# Altium schematic sheet Shematic_NANO.SchDoc: Arduino Nano
size B; Date: 2022
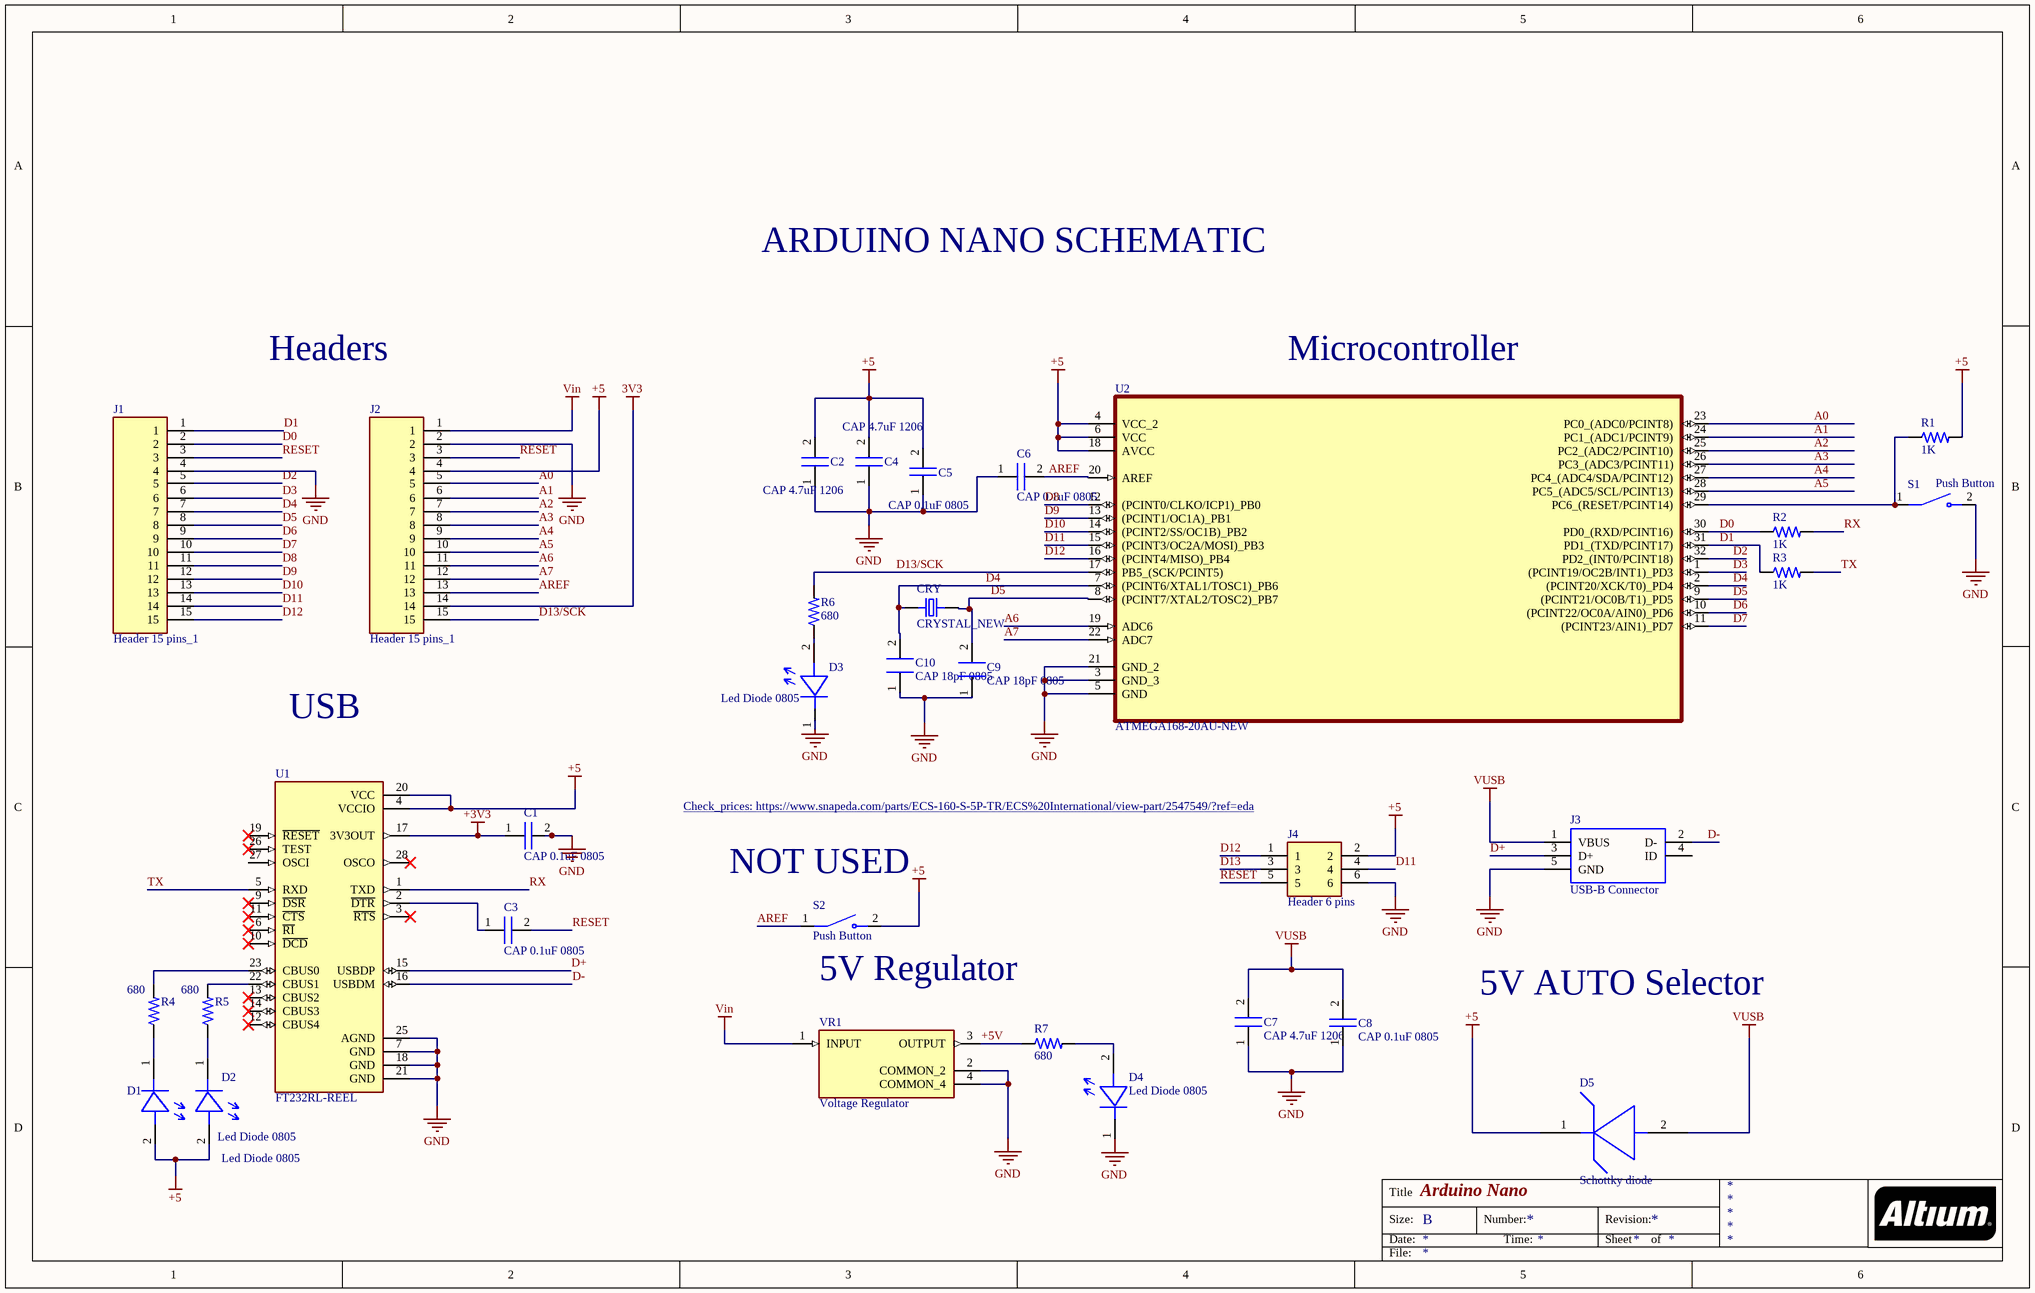
[diagram p0: Shematic_NANO.SchDoc]

## Parts
C1  CAP 0.1uF 0805  [CAP 0.1uF 0805]
C2  CAP 4.7uF 1206  [CAP 4.7 uF 1206]
C3  CAP 0.1uF 0805  [CAP 0.1uF 0805]
C4  CAP 4.7uF 1206  [CAP 4.7 uF 1206]
C5  CAP 0.1uF 0805  [CAP 0.1uF 0805]
C6  CAP 0.1uF 0805  [CAP 0.1uF 0805]
C7  CAP 4.7uF 1206  [CAP 4.7 uF 1206]
C8  CAP 0.1uF 0805  [CAP 0.1uF 0805]
C9  CAP 18pF 0805  [CAP 18pF 0805]
C10  CAP 18pF 0805  [CAP 18pF 0805]
CRY  CRYSTAL_NEW  [CRYSTAL 16MHZ]
D1  Led Diode 0805  [LED 0805]
D2  Led Diode 0805  [LED 0805]
D3  Led Diode 0805  [LED 0805]
D4  Led Diode 0805  [LED 0805]
D5  Schottky diode  [Schottky diode]
J1  Header 15 pins_1  [Header 15 pins]
J2  Header 15 pins_1  [Header 15 pins]
J3  USB-B Connector  [USB-B Connector]
J4  Header 6 pins  [Header 6 pins]
R1  1K  [RES 0402]
R2  1K  [RES 0402]
R3  1K  [RES 0402]
R4  680  [RES 0402]
R5  680  [RES 0402]
R6  680  [RES 0402]
R7  680  [RES 0402]
S1  Push Button  [Push Button]
S2  Push Button  [Push Button]
U1  FT232RL-REEL  [SOP65P780X200-28N]
U2  ATMEGA168-20AU-NEW  [ATMEGA168-20AU - duplicate]
VR1  Voltage Regulator  [Voltage Regulator]

## Nets
3V3: J2.14
+3V3: C1.1 U1.17(3V3OUT)
+5: C2.2 C4.2 C5.2 D1.2 D2.2 D5.1 J2.4 J4.2 R1.2 S2.2 U1.4(VCCIO) U1.20(VCC) U2.4(VCC_2) U2.6(VCC) U2.18(AVCC)
GND: C1.2 C2.1 C4.1 C5.1 C6.1 C7.1 C8.1 C9.1 C10.1 D3.1 D4.1 J1.4 J2.2 J3.5(GND) J4.6 S1.2 U1.7(GND) U1.18(GND) U1.21(GND) U1.25(AGND) U2.3(GND_3) U2.5(GND) U2.21(GND_2) VR1.2(COMMON_2) VR1.4(COMMON_4)
Vin: J2.1 VR1.1(INPUT)
VUSB: C7.2 C8.2 D5.2 J3.1(VBUS)
+5V: R7.1 VR1.3(OUTPUT)
A0: J2.5 U2.23(PC0_(ADC0/PCINT8))
A1: J2.6 U2.24(PC1_(ADC1/PCINT9))
A2: J2.7 U2.25(PC2_(ADC2/PCINT10))
A3: J2.8 U2.26(PC3_(ADC3/PCINT11))
A4: J2.9 U2.27(PC4_(ADC4/SDA/PCINT12))
A5: J2.10 U2.28(PC5_(ADC5/SCL/PCINT13))
A6: J2.11 U2.19(ADC6)
A7: J2.12 U2.22(ADC7)
AREF: C6.2 J2.13 S2.1 U2.20(AREF)
D0: J1.2 R2.1 U2.30(PD0_(RXD/PCINT16))
D1: J1.1 R3.1 U2.31(PD1_(TXD/PCINT17))
D2: J1.5 U2.32(PD2_(INT0/PCINT18))
D3: J1.6 U2.1((PCINT19/OC2B/INT1)_PD3)
D4: C10.2 CRY.1 J1.7 U2.2((PCINT20/XCK/T0)_PD4) U2.7((PCINT6/XTAL1/TOSC1)_PB6)
D5: C9.2 CRY.2 J1.8 U2.8((PCINT7/XTAL2/TOSC2)_PB7) U2.9((PCINT21/OC0B/T1)_PD5)
D6: J1.9 U2.10((PCINT22/OC0A/AIN0)_PD6)
D7: J1.10 U2.11((PCINT23/AIN1)_PD7)
D8: J1.11 U2.12((PCINT0/CLKO/ICP1)_PB0)
D9: J1.12 U2.13((PCINT1/OC1A)_PB1)
D10: J1.13 U2.14((PCINT2/SS/OC1B)_PB2)
D11: J1.14 J4.4 U2.15((PCINT3/OC2A/MOSI)_PB3)
D12: J1.15 J4.1 U2.16((PCINT4/MISO)_PB4)
D13: J4.3
D13/SCK: J2.15 R6.2 U2.17(PB5_(SCK/PCINT5))
D+: J3.3(D+) U1.15(USBDP)
D-: J3.2(D-) U1.16(USBDM)
RESET: C3.2 J1.3 J2.3 J4.5
RX: R2.2 U1.1(TXD)
TX: R3.2 U1.5(RXD)
NetC3_1: C3.1 U1.2(~{DTR})
NetD1_1: D1.1 R4.1
NetD2_1: D2.1 R5.1
NetD3_2: D3.2 R6.1
NetD4_2: D4.2 R7.2
NetR1_1: R1.1 S1.1 U2.29(PC6_(RESET/PCINT14))
NetR4_2: R4.2 U1.23(CBUS0)
NetR5_2: R5.2 U1.22(CBUS1)

Not connected (* = marked no-connect by the designer): J3 4(ID); U1 3(~{RTS})* 6(~{RI})* 9(~{DSR})* 10(~{DCD})* 11(~{CTS})* 12(CBUS4)* 13(CBUS2)* 14(CBUS3)* 19(~{RESET})* 26(TEST)* 27(OSCI) 28(OSCO)*

## Notes on the sheet
- ARDUINO NANO SCHEMATIC
- Headers
- Microcontroller
- USB
- (near S2) NOT USED
- (near S2) 5V Regulator
- 5V AUTO Selector
- Title
- Size:
- Date:
- B
- Number:
- Time:
- Revision:
- Sheet
- of
- File:

## Library data of the parts
CRY = CRYSTAL_NEW: 16MHz Â±30ppm Crystal Series 40 Ohms HC-49/US; MF: ECS International; MP: ECS-160-S-5P-TR; SnapEDA_Link: https://www.snapeda.com/parts/ECS-160-S-5P-TR/ECS%20International/view-part/2547549/?ref=snap; Mouser-Purchase-URL: https://snapeda.com/shop?store=Mouser&id=2547549; Value: *; Availability: Warning; Price: None; Package: HC49/US ECS International; Check_prices: https://www.snapeda.com/parts/ECS-160-S-5P-TR/ECS%20International/view-part/2547549/?ref=eda
D5 = Schottky diode: Schottky diode 0.5A 20V
J1 J2 = Header 15 pins_1: MP: 4-644456-5; Package: None; Price: None; Value: *; Availability: Unavailable
J3 = USB-B Connector: USB - mini B USB 2.0 OTG Receptacle Connector 5 Position Surface Mount, Right Angle; MF: Molex; MP: 67503-1020; SnapEDA_Link: https://www.snapeda.com/parts/67503-1020/Molex/view-part/46840/?ref=snap; Price: None; Value: *; Availability: Unavailable; Package: None
J4 = Header 6 pins: Connector Header Through Hole 6 position 0.100 _2.54mm_; MF: Amphenol ICC; MP: 67997-206HLF; SnapEDA_Link: https://www.snapeda.com/parts/67997-206HLF/Amphenol%20FCI/view-part/103429/?ref=snap; Value: *; Digi-Key_Purchase_URL: https://www.digikey.com/product-detail/en/amphenol-icc-fci/67997-206HLF/609-3234-ND/1878491?utm_source=snapeda&utm_medium=aggregator&utm_campaign=symbol; Digi-Key_Part_Number: 609-3234-ND; Package: None
R1-R7 = RES 1206: RL73H 2B R10 1% 5K RL; MP: 1-1879462-1; Package: None; Price: None; Value: *; Availability: Unavailable
S1 S2 = Push Button: Switch Tactile N.O. SPST Round Button Gull Wing 0.05A 12VDC 1.5N SMD Embossed T/R; MP: B3U-1000P; Package: None; Availability: Unavailable; Value: *; Price: None
U1 = FT232RL-REEL: USB Full Speed to Serial UART IC, Includes Oscillator and EEPROM - SSOP-28; Package: None; MP: FT232RL-REEL; Value: *; Price: None; Availability: Unavailable
U2 = ATMEGA168-20AU-NEW: AVR AVRÂ® ATmega Microcontroller IC 8-Bit 20MHz 16KB _8K x 16_ FLASH 32-TQFP _7x7_; MF: Microchip; MP: ATMEGA168-20AU; Availability: Unavailable; Package: TQFP-32 Microchip; Price: None; SnapEDA_Link: https://www.snapeda.com/parts/ATMEGA168-20AU/Microchip/view-part/776709/?ref=snap; Value: *
VR1 = Voltage Regulator: 500-mA, 30-V, linear voltage regulator 4-SOT-223 0 to 125; MP: UA78M05CDCYRG3; MF: Texas Instruments; SnapEDA_Link: https://www.snapeda.com/parts/UA78M05CDCYRG3/Texas+Instruments/view-part/?ref=snap; Package: SOT-223-4 Texas Instruments; Value: *; Purchase-URL: https://pricing.snapeda.com/search/part/UA78M05CDCYRG3/?ref=eda; Check_prices: https://www.snapeda.com/parts/UA78M05CDCYRG3/Texas+Instruments/view-part/?ref=eda; Availability: In Stock; Price: None